# Altium schematic sheet VDD.SchDoc
size A4
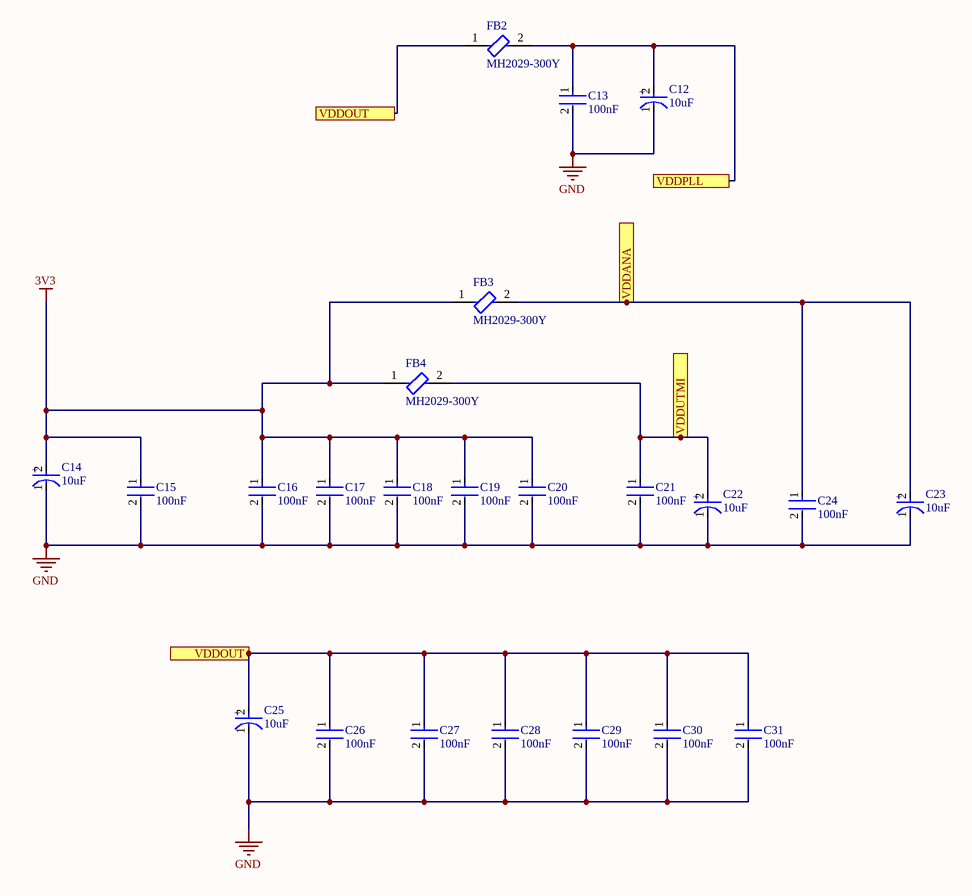
[diagram p0: VDD.SchDoc]

## Parts
C12  10uF  [FP-TAJP-MFG]
C13  100nF  [FP-0805-L_2_01_0_2-W_1_25-IPC_B]
C14  10uF  [FP-TAJP-MFG]
C15  100nF  [FP-0805-L_2_01_0_2-W_1_25-IPC_B]
C16  100nF  [FP-0805-L_2_01_0_2-W_1_25-IPC_B]
C17  100nF  [FP-0805-L_2_01_0_2-W_1_25-IPC_B]
C18  100nF  [FP-0805-L_2_01_0_2-W_1_25-IPC_B]
C19  100nF  [FP-0805-L_2_01_0_2-W_1_25-IPC_B]
C20  100nF  [FP-0805-L_2_01_0_2-W_1_25-IPC_B]
C21  100nF  [FP-0805-L_2_01_0_2-W_1_25-IPC_B]
C22  10uF  [FP-TAJP-MFG]
C23  10uF  [FP-TAJP-MFG]
C24  100nF  [FP-0805-L_2_01_0_2-W_1_25-IPC_B]
C25  10uF  [FP-TAJP-MFG]
C26  100nF  [FP-0805-L_2_01_0_2-W_1_25-IPC_B]
C27  100nF  [FP-0805-L_2_01_0_2-W_1_25-IPC_B]
C28  100nF  [FP-0805-L_2_01_0_2-W_1_25-IPC_B]
C29  100nF  [FP-0805-L_2_01_0_2-W_1_25-IPC_B]
C30  100nF  [FP-0805-L_2_01_0_2-W_1_25-IPC_B]
C31  100nF  [FP-0805-L_2_01_0_2-W_1_25-IPC_B]
FB2  MH2029-300Y  [FP-MH2029-MFG]
FB3  MH2029-300Y  [FP-MH2029-MFG]
FB4  MH2029-300Y  [FP-MH2029-MFG]

## Ports
VDDANA, VDDOUT, VDDPLL, VDDUTMI

## Nets
3V3: C14.2(A) C15.1 C16.1 C17.1 C18.1 C19.1 C20.1 FB3.1 FB4.1
GND: C12.1(C) C13.2 C14.1(C) C15.2 C16.2 C17.2 C18.2 C19.2 C20.2 C21.2 C22.1(C) C23.1(C) C24.2 C25.1(C) C26.2 C27.2 C28.2 C29.2 C30.2 C31.2
VDDANA: C23.2(A) C24.1 FB3.2 ; port VDDANA
VDDOUT: C25.2(A) C26.1 C27.1 C28.1 C29.1 C30.1 C31.1 FB2.1 ; port VDDOUT
VDDPLL: C12.2(A) C13.1 FB2.2 ; port VDDPLL
VDDUTMI: C21.1 C22.2(A) FB4.2 ; port VDDUTMI

## Notes on the sheet
- (in symbol CMP-2007-04028-2) +

## Library data of the parts
C12 C14 C22 C23 C25 = CMP-2007-04028-2: 10uF 10V  ±20% 6Ω 0805  SMD Tantalum Capacitor; Dissipation Factor: 8%; ESR (Equivalent Series Resistance): 6R; Polarity: Polar; Leakage Current: 1uA; Height: 1.5mm; Packaging: Tape and Reel; Max Operating Temperature: 125°C; Lead Free: Lead Free; Length: 2.05mm; RoHS Compliant: Yes; Number of Pins: 2; Case Code (Metric): 2012; Series: TAJ; Height - Seated (Max): 0.059inch; Mount: Surface Mount; REACH SVHC: No SVHC; Depth: 1.35mm; Tolerance: 20%; Case Code (Imperial): 0805; Dielectric Material: Tantalum; Features: General Purpose; Voltage: 10V; Capacitance: 10uF; Package Quantity: 1; Case/Package: 0805; Voltage Rating (DC): 10V; Termination: SMD/SMT; Width: 0.053inch; Min Operating Temperature: -55°C; Voltage Rating: 10V
C13 C15-C21 C24 C26-C31 = CMP-2007-04174-2: General Purpose Ceramic Capacitor, 0805, 100nF, 10%, X7R, 15%, 100V; Packaging: Tape and Reel; Min Operating Temperature: -55°C; Dielectric Material: Ceramic; Height: 1.4mm; Voltage Rating: 100V; Termination: SMD/SMT; Case Code (Imperial): 0805; Case Code (Metric): 2012; Case/Package: 0805; Construction: Flat; Radiation Hardening: No; Series: -; Dielectric: X7R; Package Quantity: 2000; Mount: Surface Mount; Capacitance: 100nF; Contact Plating: Tin; Voltage: 100V; Lead Free: Lead Free; Depth: 1.25mm; RoHS Compliant: Yes; Number of Pins: 2; Max Operating Temperature: 125°C; Length: 2.01mm; Voltage Rating (DC): 100V; Thickness: 0.055inch; REACH SVHC: No SVHC; Width: 0.049inch; Tolerance: 10%
FB2-FB4 = CMP-07252-000001-1: FERRITE BEAD 30 OHM 0805 1LN; Manufacturer: Bourns; Series Resistance: 25mΩ; Resistance: 30Ω; Value: 30Ω; Impedance At Frequency: 30Ω @ 100MHz; Rms Current: 3A; Tolerance: 25%; RoHS: TRUE; Manufacturer Part Number: MH2029-300Y; Temperature Range High: +125°C; Device Class L3: Ferrite Beads and Chips; Core Material: Ferrite; ComponentLink2Description: Datasheet; Category: FBead; Octopart: https://octopart.com/mh2029-300y-bourns-756929; Digikey Description: FERRITE BEAD 30 OHM 0805 1LN; Device Class L2: EMI / RFI Components; Lead Free: Yes; Mouser Description: Ferrite Beads 30 ohms 25% HIGH CURRENT; Automotive: No; Ipc Land Pattern Name: CAPC200120X90; Temperature: -55°C to +125°C; Device Class L1: Passive Components; Height: 1.1mm; ComponentLink2URL: https://www.bourns.com/docs/Product-Datasheets/mh.pdf; Package: MH2029; Temperature Range Low: -55°C